# Altium schematic sheet ACMotor_Control.SchDoc: Наименование
size 420 x 297 mm; ApprovedBy: Сидоров; CheckedBy: Петров; Author: Иванов; CompanyName: РГППУ; Title2str: Изделия; DecimalNumber: АБВГ.123456.001 33
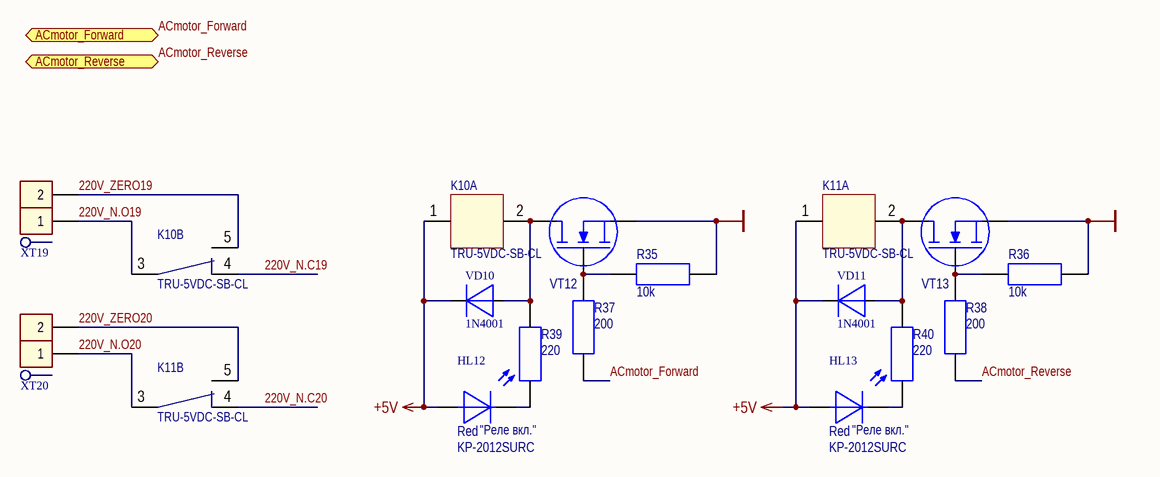
[diagram p0: ACMotor_Control.SchDoc]

## Parts
HL12  Red  ManufacturerPartNumber: KP-2012SURC  [DIOMELF2012M]
HL13  Red  ManufacturerPartNumber: KP-2012SURC  [DIOMELF2012M]
K10  TRU-5VDC-SB-CL  [TRU-5VDC-SB-CL]  (parts A,B of 2)
K11  TRU-5VDC-SB-CL  [TRU-5VDC-SB-CL]  (parts A,B of 2)
R35  10k  [SMDRC0805]
R36  10k  [SMDRC0805]
R37  200  [SMDRC0805]
R38  200  [SMDRC0805]
R39  220  [SMDRC0805]
R40  220  [SMDRC0805]
VD10  1N4001  [PinDiode]
VD11  1N4001  [PinDiode]
VT12  2N7002  [SOT23 (TO-236AB)]  (value not drawn)
VT13  2N7002  [SOT23 (TO-236AB)]  (value not drawn)
XT19  305-021-12  [330-021-12]  (value not drawn)
XT20  305-021-12  [330-021-12]  (value not drawn)

## Ports
ACmotor_Forward (in), ACmotor_Reverse (in)

## Nets
+5V: HL12.1 HL13.1 K10.1 K11.1 VD10.K VD11.K
GND: R35.2 R36.2 VT12.2(S) VT13.2(S)
220V_N.C19: K10.4
220V_N.C20: K11.4
220V_N.O19: K10.3 XT19.1
220V_N.O20: K11.3 XT20.1
220V_ZERO19: K10.5 XT19.2
220V_ZERO20: K11.5 XT20.2
ACmotor_Forward: R37.1 ; port ACmotor_Forward
ACmotor_Reverse: R38.1 ; port ACmotor_Reverse
NetHL12_2: HL12.2 R39.2
NetHL13_2: HL13.2 R40.2
NetK10_2: K10.2 R39.1 VD10.A VT12.3(D)
NetK11_2: K11.2 R40.1 VD11.A VT13.3(D)
NetR35_1: R35.1 R37.2 VT12.1(G)
NetR36_1: R36.1 R38.2 VT13.1(G)

## Notes on the sheet
- (near HL12) "Реле вкл."
- (near HL13) "Реле вкл."
- Изм.
- Лист
- N*докум.
- Подп.
- Дата
- Лит.
- Масса
- Масштаб
- Разраб.
- Пров.
- Т.контр.
- Лиcт
- Лиcтов
- Н.контр.
- Утв.

## Library data of the parts
HL12 HL13 = LED1_R: Diod LED SMD Red; ComponentLink1Description: Datasheet; Cost: 5,01; ComponentLink2Description: Datasheet-local; ComponentLink2URL: *; Color: Red
R35 R36 = Resistor 0805 10k: Generic resistor; PartNumber: Resistor 0805 10k; Value: 10k; ComponentLink1URL: http://www.mouser.com/ds/2/447/PYu-RC0402_51_RoHS_L_6_r-8721.pdf; ComponentLink1Description: Datasheet; Package: 0805
R37 R38 = Resistor 0805 200: Generic resistor; PartNumber: Resistor 0805 200; Value: 200; ComponentLink1URL: http://www.mouser.com/ds/2/447/PYu-RC0402_51_RoHS_L_6_r-8721.pdf; ComponentLink1Description: Datasheet; Package: 0805
R39 R40 = Resistor 0805 220: Generic resistor; PartNumber: Resistor 0805 220; Value: 220; ComponentLink1URL: http://www.mouser.com/ds/2/447/PYu-RC0402_51_RoHS_L_6_r-8721.pdf; ComponentLink1Description: Datasheet; Package: 0805
VD10 VD11 = 1N4001: Rectifying diode; ComponentLink1Description: Datasheet; ComponentLink1URL: http://www.promelec.ru/pdf/1N400x.pdf; Cost: 5; Package: штырьевой; ComponentLink2Description: Datasheet-local; ComponentLink2URL: *; ManufacturerPartNumber: 1N4001
VT12 VT13 = 2N7002 n-MOSFET: 60V, 300mA N-channel Trench MOSFET; ManufacturerPartNumber: 2N7002
XT19 XT20 = Con2_D 305-021-12: Demountable connection  2-pin; Manufacturer: Degson Electronics Co., Ltd; ManufacturerPartNumber: 305-021-12; ComponentLink1Description: Datasheet; Cost: 7,45; Supplier: Промэлектроника; ComponentLink2Description: Datasheet-local
K10 K11 = TRU-5VDC-SB-CL: ManufacturerPurtNumber: TRU-5VDC-SB-CL